# Altium schematic sheet handle_interconnect.schdoc: Handle Interconnect Board
size 431 x 279 mm; DrawnBy: D. Bruey, M. Ciuffo; Organization: Synapse Product Development, LLC.; Address1: 1511 6th Ave., Suite 400; Address2: Seattle, Washington 98101; Address3: 206.381.0898; Address4: www.synapse.com; DocumentNumber: 1; SheetNumber: 1; SheetTotal: 2; PageSetup: Record=PageOptions|CenterHorizontal=True|CenterVertical=True|PrintScale=1.06|XCorrection=1.00|YCorrection=1.00|PrintKind=1|BorderSize=5000000|LeftOffset=0|BottomOffset=0|Orientation=2|PaperLength=4318|PaperWidth=2794|Scale=100|PaperSource=7|PrintQuality=200|MediaType=1|DitherType=10|PrintScaleMode=1|PaperKind=11x17|PaperIndex=3
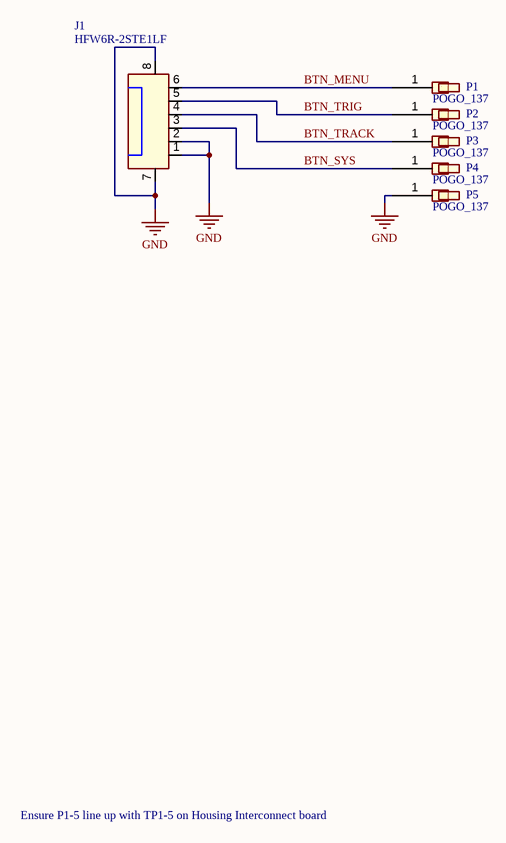
[diagram p0: handle_interconnect.schdoc]

## Parts
J1  HFW6R-2STE1LF  [CON_FCI_HFW6R]
P1  POGO_137  [POGO_MILLMAX_0900-76]
P2  POGO_137  [POGO_MILLMAX_0900-76]
P3  POGO_137  [POGO_MILLMAX_0900-76]
P4  POGO_137  [POGO_MILLMAX_0900-76]
P5  POGO_137  [POGO_MILLMAX_0900-76]

## Nets
GND: J1.1 J1.2 J1.7 J1.8 P5.1
BTN_MENU: J1.6 P1.1
BTN_SYS: J1.3 P4.1
BTN_TRACK: J1.4 P3.1
BTN_TRIG: J1.5 P2.1

## Notes on the sheet
- Ensure P1-5 line up with TP1-5 on Housing Interconnect board
- Design Notes:
- Layout Notes:
- Project:
- Sheet Title:
- PCBA:
- PROPRIETARY AND CONFIDENTIAL
- Drawn by:
- Schematic Part Number:
- Schematic Revision:
- Date:
- Sheet:
- /

## Library data of the parts
J1 = HFW6R-2STE1LF: CONN FFC FPC TOP 6POS 1.00MM R/A; part_type: ffc/fpc; id: 1658; mfg: Amphenol FCI; dist: DIGIKEY; dist_pn: 609-1787-1-ND; positions: 6; TableName: viewAltiumConnectors; mfg_pn: HFW6R-2STE1LF; height: 1.9mm; status: Unknown
P1-P5 = 0900-0-15-20-76-14-11-0: CONN SPRING LOADED PIN .137 GOLD; part_type: connector; id: 1660; mfg: MILL-MAX; dist: DIGIKEY; dist_pn: ED9000-ND; positions: 1; TableName: viewAltiumConnectors; mfg_pn: 0900-0-15-20-76-14-11-0; source_package: POGO; status: Unknown